# EAGLE design Device_Measurement_v1.4 (EAGLE 6.5.0)
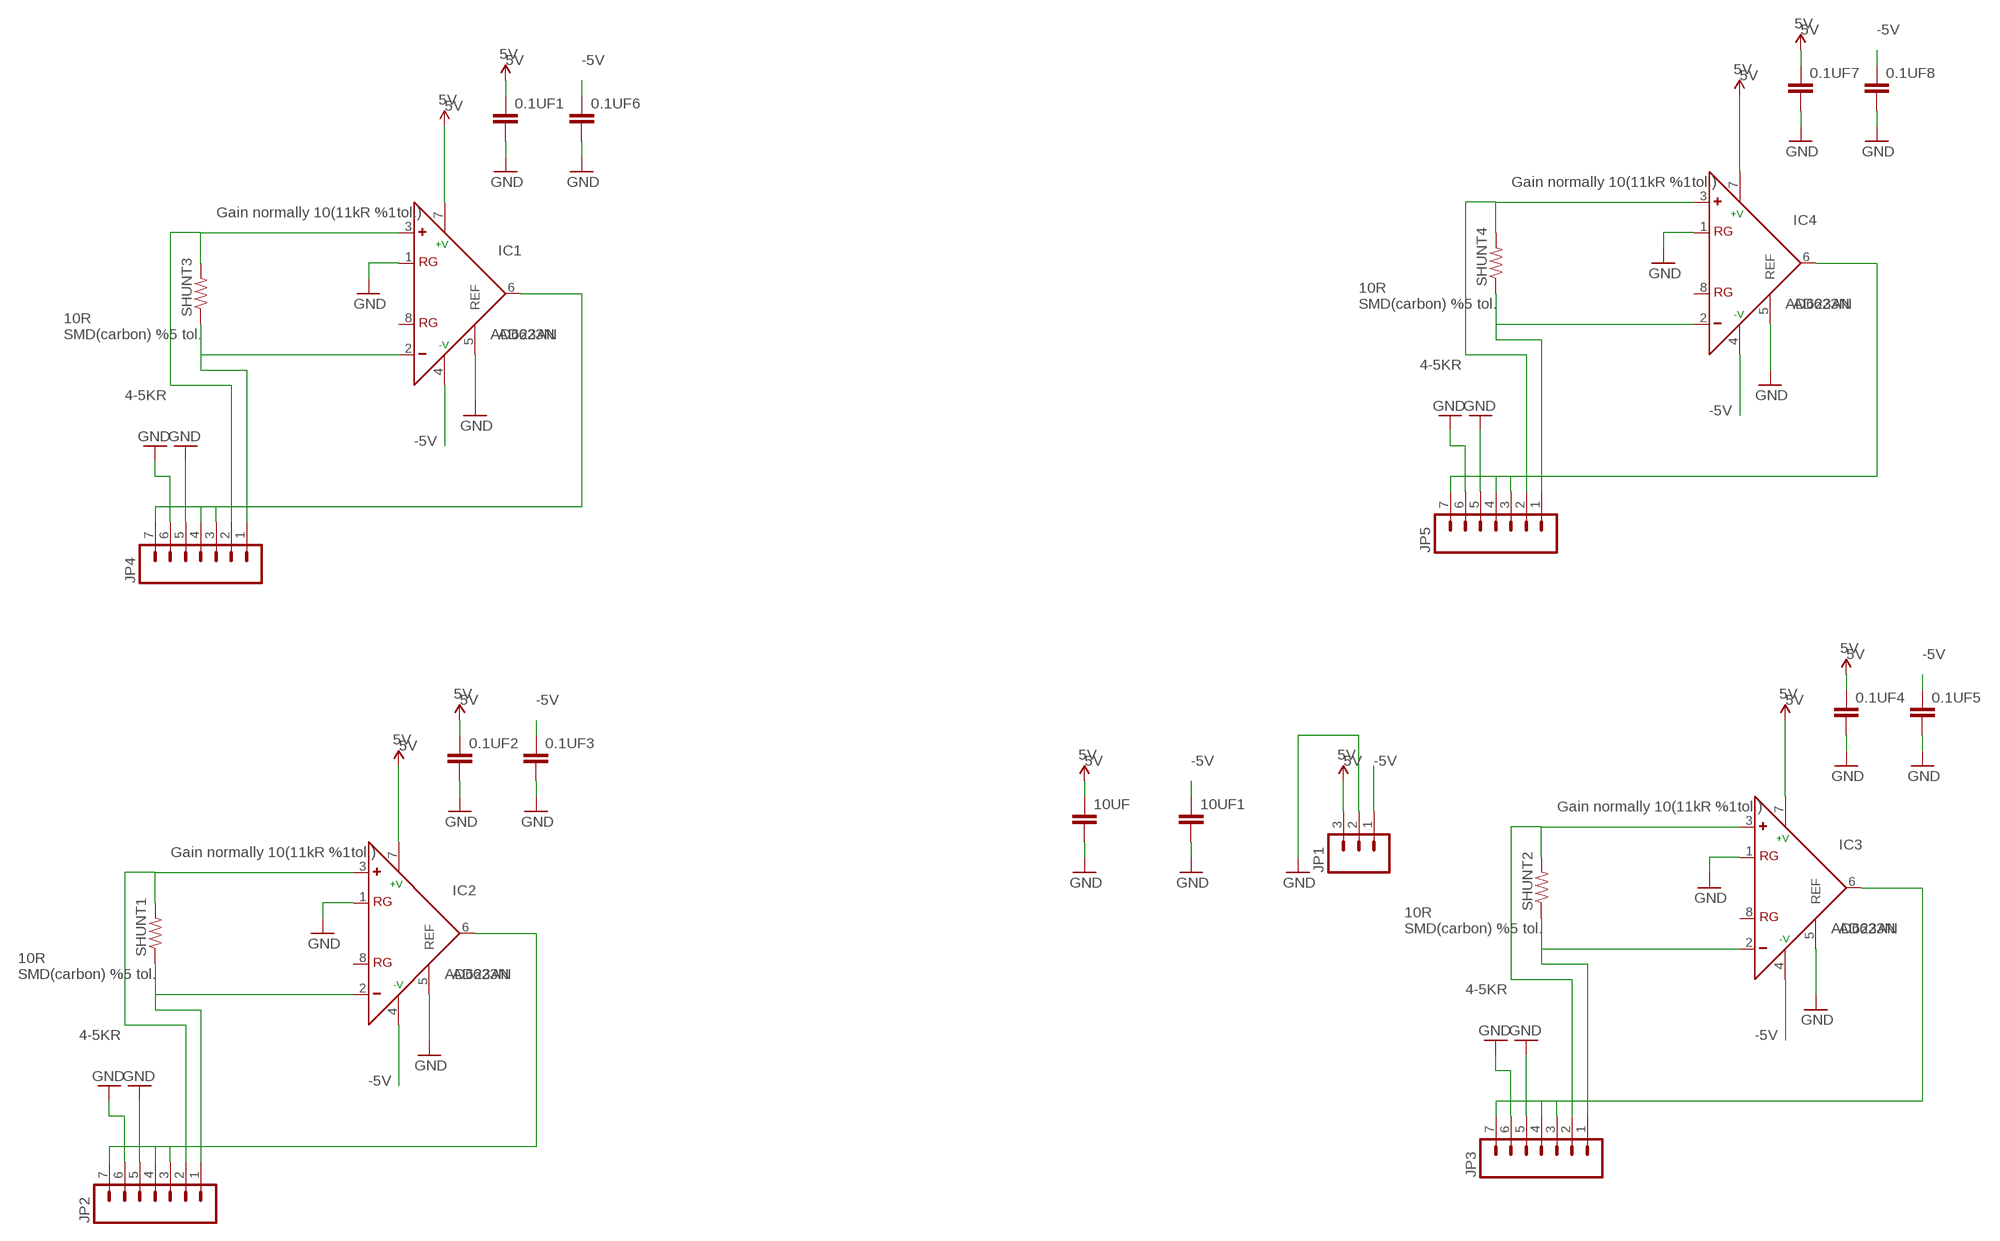
[diagram p0: schematic, sheet 1]

## Parts
0.1UF1  CAPPTH1  [CAP-PTH-5MM]
0.1UF2  CAPPTH1  [CAP-PTH-5MM]
0.1UF3  CAPPTH1  [CAP-PTH-5MM]
0.1UF4  CAPPTH1  [CAP-PTH-5MM]
0.1UF5  CAPPTH1  [CAP-PTH-5MM]
0.1UF6  CAPPTH1  [CAP-PTH-5MM]
0.1UF7  CAPPTH1  [CAP-PTH-5MM]
0.1UF8  CAPPTH1  [CAP-PTH-5MM]
10UF  CAPPTH1  [CAP-PTH-5MM]
10UF1  CAPPTH1  [CAP-PTH-5MM]
IC1  AD623N  [DIL08]
IC2  AD623N  [DIL08]
IC3  AD623N  [DIL08]
IC4  AD623N  [DIL08]
JP1  M03LOCK  [1X03_LOCK]
JP2  M07  [1X07]
JP3  M07  [1X07]
JP4  M07  [1X07]
JP5  M07  [1X07]
SHUNT1  RESISTOR1206  [1206]
SHUNT2  RESISTOR1206  [1206]
SHUNT3  RESISTOR1206  [1206]
SHUNT4  RESISTOR1206  [1206]

## Nets
5V: 0.1UF1.1 0.1UF2.1 0.1UF4.1 0.1UF7.1 10UF.1 IC1.7(+V) IC2.7(+V) IC3.7(+V) IC4.7(+V) JP1.3
-5V: 0.1UF3.1 0.1UF5.1 0.1UF6.1 0.1UF8.1 10UF1.1 IC1.4(-V) IC2.4(-V) IC3.4(-V) IC4.4(-V) JP1.1
GND: 0.1UF1.2 0.1UF2.2 0.1UF3.2 0.1UF4.2 0.1UF5.2 0.1UF6.2 0.1UF7.2 0.1UF8.2 10UF1.2 10UF.2 IC1.1(RG) IC1.5(REF) IC2.1(RG) IC2.5(REF) IC3.1(RG) IC3.5(REF) IC4.1(RG) IC4.5(REF) JP1.2 JP2.5 JP2.6 JP3.5 JP3.6 JP4.5 JP4.6 JP5.5 JP5.6
N$1: IC2.3(+) JP2.2 SHUNT1.2
N$2: IC2.2(-) JP2.1 SHUNT1.1
N$3: IC1.3(+) JP4.2 SHUNT3.2
N$4: IC1.2(-) JP4.1 SHUNT3.1
N$5: IC1.6(OUT) JP4.7
N$6: JP4.3 JP4.4
N$7: IC3.3(+) JP3.2 SHUNT2.2
N$8: IC2.6(OUT) JP2.7
N$9: JP2.3 JP2.4
N$10: IC3.2(-) JP3.1 SHUNT2.1
N$11: IC3.6(OUT) JP3.7
N$12: JP3.3 JP3.4
N$13: IC4.3(+) JP5.2 SHUNT4.2
N$14: IC4.2(-) JP5.1 SHUNT4.1
N$15: IC4.6(OUT) JP5.7
N$16: JP5.3 JP5.4
Unconnected: IC1.8(RG) IC2.8(RG) IC3.8(RG) IC4.8(RG)

## Notes on the sheet
- 5V
- 5V
- 5V
- 5V
- Gain normally 10(11kR %1tol.)
- Gain normally 10(11kR %1tol.)
- 10R
  SMD(carbon) %5 tol.
- AD623AN
- 10R
  SMD(carbon) %5 tol.
- AD623AN
- 4-5KR
- 4-5KR
- 5V
- 5V | 5V
- 5V
- 5V | 5V
- Gain normally 10(11kR %1tol.)
- Gain normally 10(11kR %1tol.)
- 10R
  SMD(carbon) %5 tol.
- AD623AN
- 10R
  SMD(carbon) %5 tol.
- AD623AN
- 4-5KR
- 4-5KR

## Library data of the parts
0.1UF1-0.1UF8 10UF 10UF1 = SparkFun-Capacitors:CAP: Capacitor Standard 0603 ceramic capacitor, and 0.1" leaded capacitor.
IC1-IC4 = analog-devices:AD623: Single-Supply, Rail-to-Rail, Low Cost Instrumentation Amplifier Source: http://www.analog.com/static/imported-files/data_sheets/AD623.pdf; MF: ALTERA CORPORATION; MPN: AD623ANZ; OC_FARNELL: 9603700; OC_NEWARK: 59K4402
JP1 = SparkFun-Connectors:M03: Header 3 Standard 3-pin 0.1" header. Use with straight break away headers (SKU : PRT-00116), right angle break away headers (PRT-00553), swiss pins (PRT-00743), machine pins (PRT-00117), and female headers (PRT-00115). Molex polarized connector foot print use with SKU : PRT-08232 with associated crimp pins and housings.
JP2-JP5 = SparkFun-Connectors:M07: Header 7 Standard 7-pin 0.1" header. Use with straight break away headers (SKU : PRT-00116), right angle break away headers (PRT-00553), swiss pins (PRT-00743), machine pins (PRT-00117), and female headers (PRT-00115). NOTES ON THE VARIANTS LOCK and LOCK_LONGPADS... This footprint was designed to help hold the alignment of a through-hole component (i.e. 7-pin header) while soldering it into place. You may notice that each hole has been shifted either up or down by 0.005 of an inch from it's more standard position (which is usually a perfectly straight line). This slight alteration caused the pins (the squares in the middle) to touch the edges of the holes. Because they are alternating, it causes a "brace" to hold the header in place. 0.005 has proven to be the perfect amount of "off-center" position when using our standard breakaway headers. Although looks a little odd when you look at the bare footprint, once you have a header in there, the alteration is very hard to notice. Also, if you push a header all the way into place, it is covered up entirely on the bottom side. This idea of altering the position of holes to aid alignment will be further integrated into the Sparkfun Library for other footprints. It can help hold any component with 3 or more connection pins.
SHUNT1-SHUNT4 = SparkFun-Resistors:RESISTOR: Resistor Basic schematic elements and footprints for 0603, 1206, and PTH resistors.

## Board
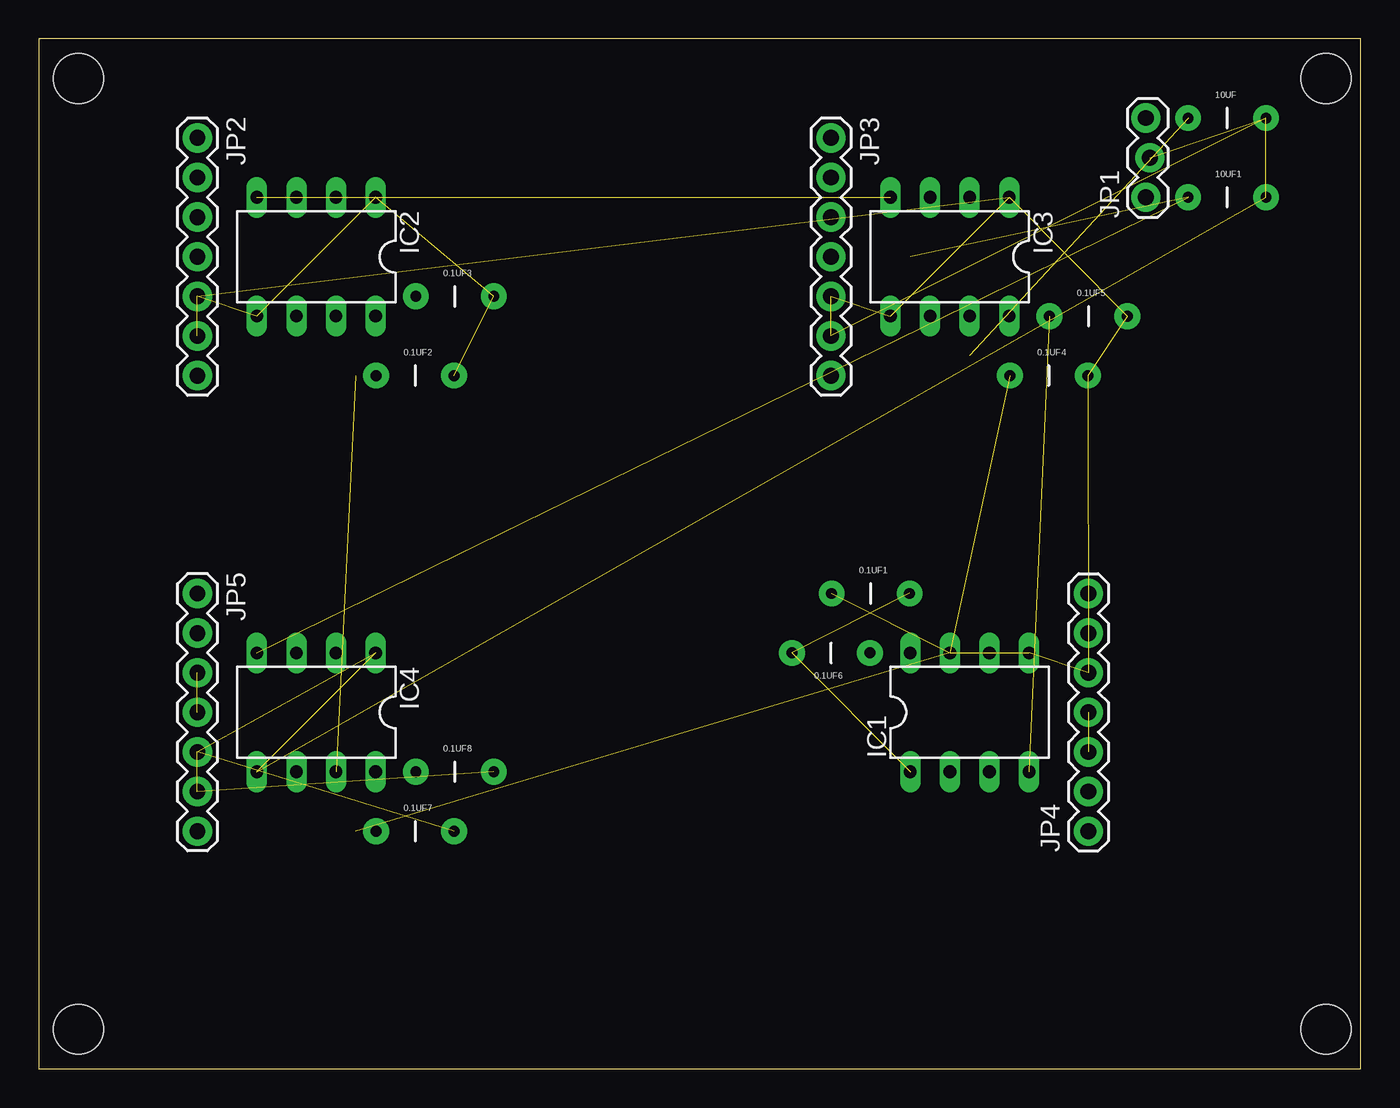
[diagram p1: board, top side]
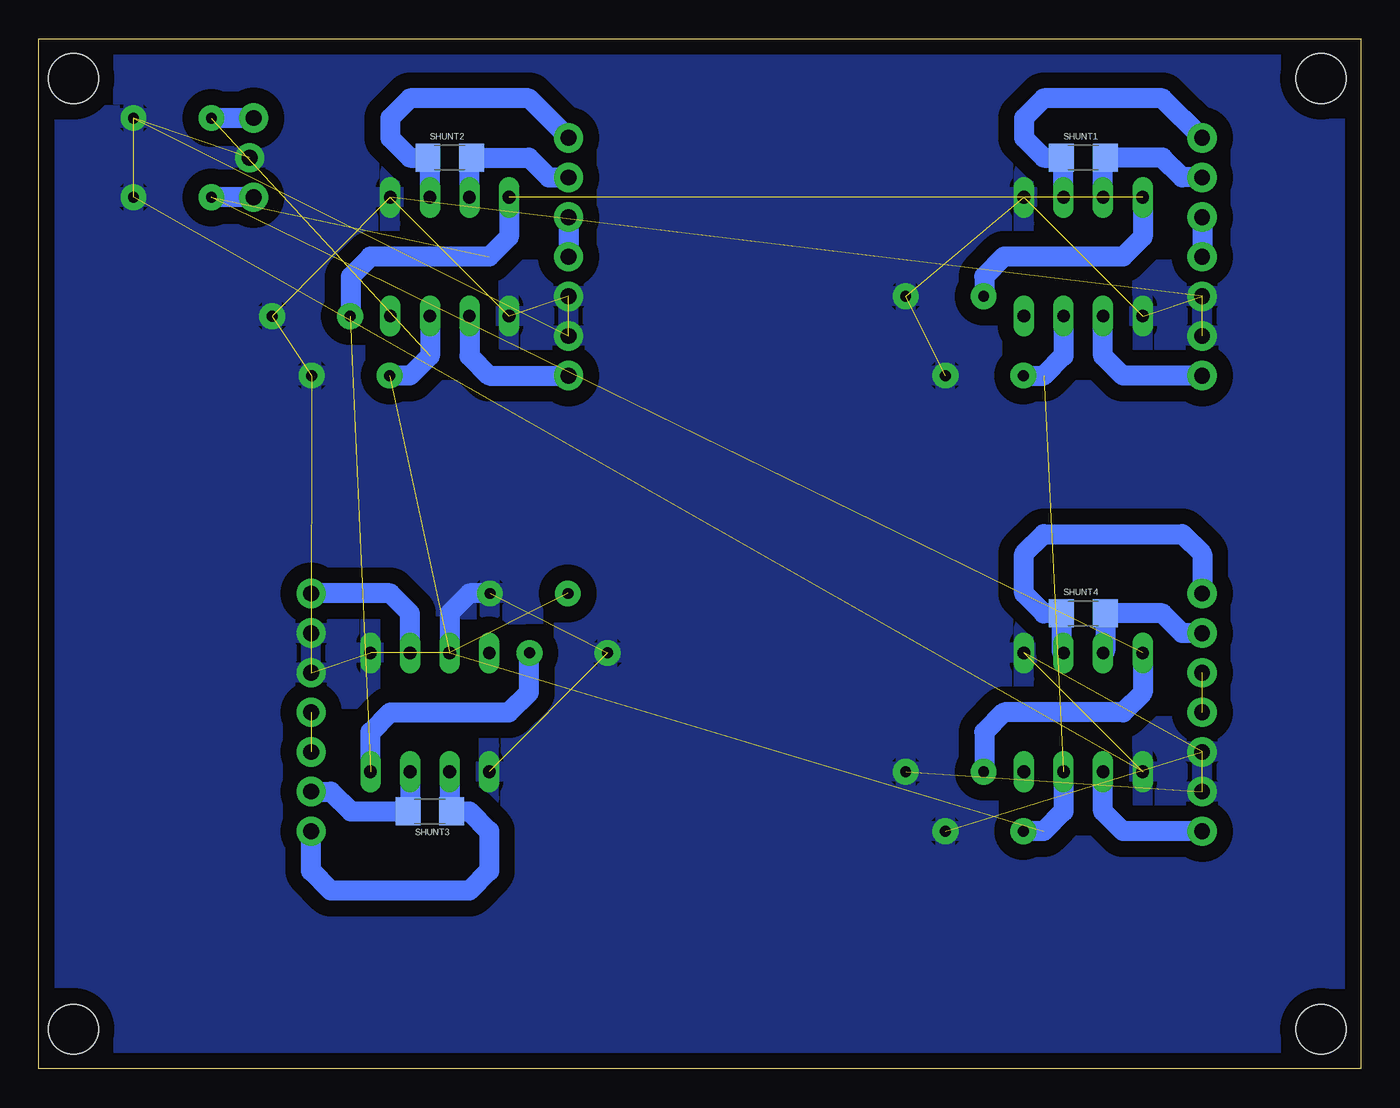
[diagram p2: board, bottom side, seen from below]

Size 84.76 x 66.03 mm. Coordinates in mm from the lower left corner, seen from the top.
Outline: 0,0 84.76,0 84.76,66.03 0,66.03 0,0
Copper layers (1*16): Top 0.035mm / dielectric 1.5mm / Bottom 0.035mm
Design rules "default": minimum track width 10mil, minimum drill 24mil, track to track 8mil, track to pad 8mil, pad to pad 8mil, via to via 8mil, smd to smd 8mil, copper to edge 40mil, drill to drill 8mil, minimum pad ring 10mil, minimum via ring 8mil, stop-mask expansion 4mil, vias tented up to drill 0mil, thermal gap 10mil
Holes 3.2 mm at 2.54,63.5 82.55,63.5 82.55,2.54 2.54,2.54

### Footprints (pad centres in the part's own frame; a part is rotated, then mirrored left to right if it is on the bottom)
CAP-PTH-5MM = drill 0.7 pad 1.651: 1 -2.5,0; 2 2.5,0
DIL08 = drill 0.813 long: 1 -3.81,-3.81; 2 -1.27,-3.81; 3 1.27,-3.81; 4 3.81,-3.81; 5 3.81,3.81; 6 1.27,3.81; 7 -1.27,3.81; 8 -3.81,3.81
1X03_LOCK = drill 1.016 pad 1.88: 1 0,0.127; 2 2.54,-0.127; 3 5.08,0.127
1X07 = drill 1.016 pad 1.88: 1 0,0; 2 2.54,0; 3 5.08,0; 4 7.62,0; 5 10.16,0; 6 12.7,0; 7 15.24,0
1206 = smd 1.6 x 1.8: 1 -1.4,0; 2 1.4,0

### Placement (x,y rotation side)
0.1UF1  53.34,30.48 0 top
0.1UF2  24.13,44.45 0 top
0.1UF3  26.67,49.53 0 top
0.1UF4  64.77,44.45 0 top
0.1UF5  67.31,48.26 0 top
0.1UF6  50.8,26.67 180 top
0.1UF7  24.13,15.24 0 top
0.1UF8  26.67,19.05 0 top
10UF  76.2,60.96 0 top
10UF1  76.2,55.88 0 top
IC1  59.69,22.86 0 top
IC2  17.78,52.07 180 top
IC3  58.42,52.07 180 top
IC4  17.78,22.86 180 top
JP1  71.12,55.88 90 top
JP2  10.16,59.69 270 top
JP3  50.8,59.69 270 top
JP4  67.31,15.24 90 top
JP5  10.16,30.48 270 top
SHUNT1  17.78,58.42 0 bottom
SHUNT2  58.42,58.42 0 bottom
SHUNT3  59.69,16.51 180 bottom
SHUNT4  17.78,29.21 0 bottom

### Tracks (layer width: path | path; a pad name or v marks a point on that pad's centre or on a via)
5V  (5 unrouted)
  Bottom 1.27: 0.1UF2.1 20.32,44.45 19.05,45.72 IC2.7 | IC3.7 59.69,45.72 60.96,44.45 0.1UF4.1 | JP1.3 10UF.1 | IC4.7 19.05,16.51 20.32,15.24 0.1UF7.1
-5V  (4 unrouted)
  Bottom 1.27: IC2.4 13.97,53.34 15.24,52.07 22.86,52.07 24.13,50.8 24.13,49.57 0.1UF3.1 | IC3.4 54.61,53.34 55.88,52.07 63.5,52.07 64.77,50.8 64.77,48.3 0.1UF5.1 | JP1.1 10UF1.1 | IC4.4 13.97,24.13 15.24,22.86 22.86,22.86 24.13,21.59 24.13,19.09 0.1UF8.1 | IC1.4 63.5,21.59 62.23,22.86 54.61,22.86 53.34,24.13 53.34,26.63 0.1UF6.1
GND  (26 unrouted)
  Bottom 1.27: 0.1UF1.2 57.15,30.48 58.42,29.21 58.42,26.67
  pour Bottom (isolate 1.016): 0,66.04 0,0 85.09,0 85.09,66.04
N$1
  Bottom 1.27: JP2.2 11.43,57.15 12.7,58.42 SHUNT1.2 16.51,58.29 IC2.3
N$2
  Bottom 1.27: JP2.1 12.7,62.23 20.32,62.23 21.59,60.96 21.59,59.69 20.32,58.42 SHUNT1.1 19.05,58.29 IC2.2
N$3
  Bottom 1.27: JP4.2 66.04,17.78 64.77,16.51 SHUNT3.2 60.96,16.64 IC1.3
N$4
  Bottom 1.27: JP4.1 67.31,12.7 66.04,11.43 57.15,11.43 55.88,12.7 55.88,15.24 57.15,16.51 SHUNT3.1 58.42,16.64 IC1.2
N$5
  Bottom 1.27: IC1.6 60.96,29.21 62.23,30.48 JP4.7
N$6  (1 unrouted)
N$7
  Bottom 1.27: IC3.3 57.15,58.29 SHUNT2.2 53.34,58.42 52.07,57.15 JP3.2
N$8
  Bottom 1.27: JP2.7 15.24,44.45 16.51,45.72 IC2.6
N$9
  Bottom 1.27: JP2.3 JP2.4
N$10
  Bottom 1.27: IC3.2 59.69,58.29 SHUNT2.1 60.96,58.42 62.23,59.69 62.23,60.96 60.96,62.23 53.34,62.23 JP3.1
N$11
  Bottom 1.27: IC3.6 57.15,45.72 55.88,44.45 JP3.7
N$12
  Bottom 1.27: JP3.3 JP3.4
N$13
  Bottom 1.27: IC4.3 16.38,26.8 SHUNT4.2 12.7,29.21 11.43,27.94 JP5.2
N$14
  Bottom 1.27: IC4.2 19.18,26.8 SHUNT4.1 20.32,29.21 21.59,30.48 21.59,33.02 20.32,34.29 11.43,34.29 10.16,33.02 JP5.1
N$15
  Bottom 1.27: JP5.7 15.24,15.24 16.51,16.51 IC4.6
N$16  (1 unrouted)